# Altium project Heli Altium Projectr.PrjPCB
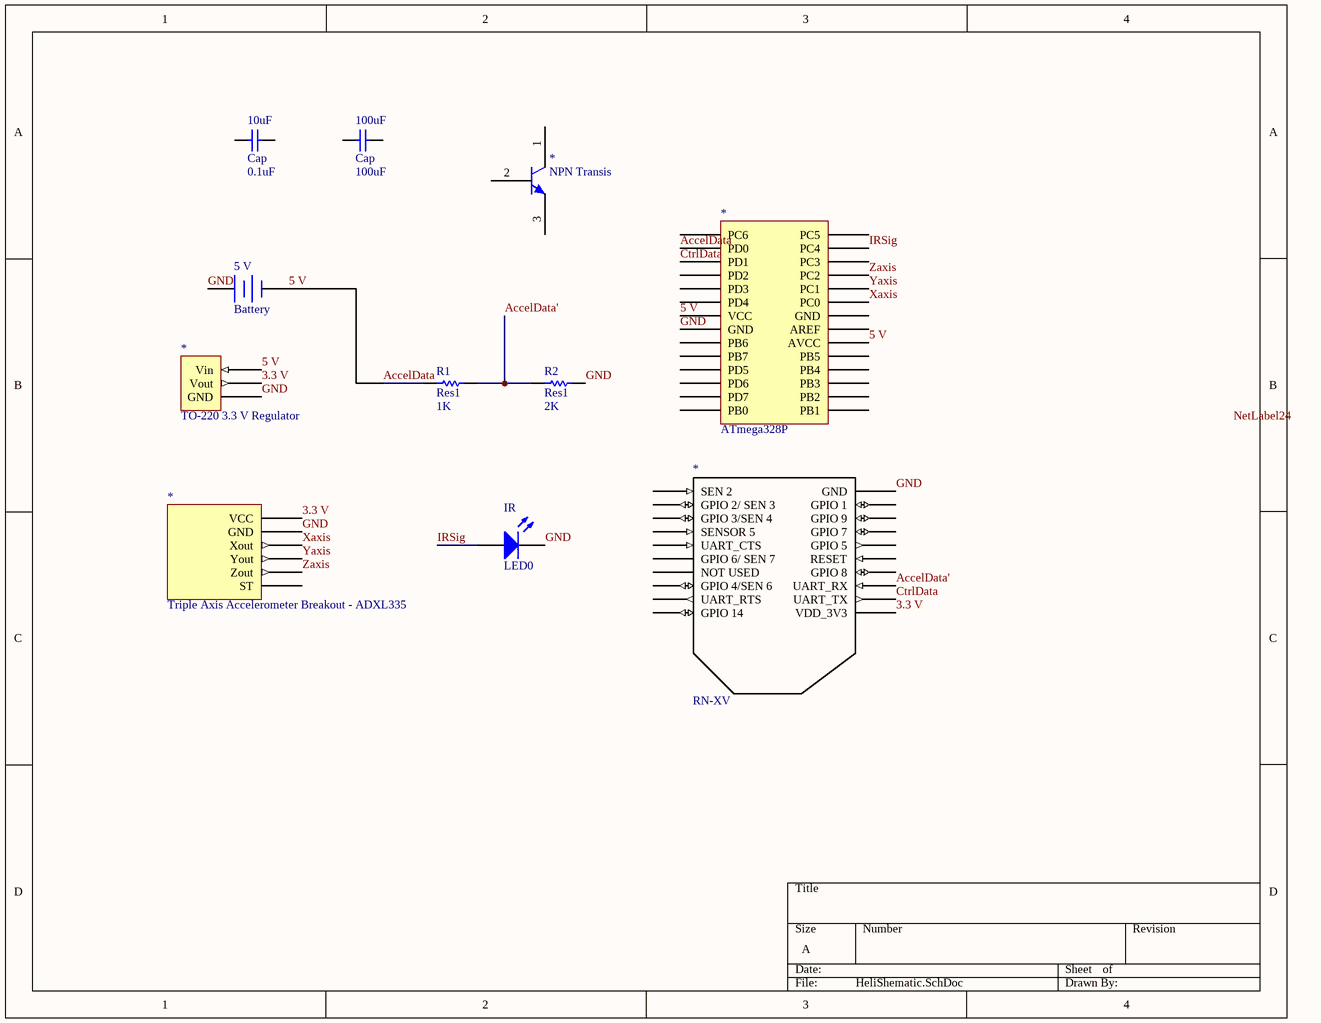
[diagram p0: HeliShematic.SchDoc]
1 sheet, 11 parts. Net scope: global (net labels, ports and power ports of the same name join across sheets).

## Sheet HeliShematic.SchDoc
size A

### Parts
(Parts that share a designator on the sheet are numbered #1, #2 ... from top to bottom, then left to right.)
5_V  Battery  [BAT-2]
10uF  Cap  value 0.1uF  [CAPC2012X14N]
100uF  Cap  value 100uF  [Capacitor 100uF]
*#1  NPN Transis  [SOT95P237X112-3N]
*#2  ATmega328P
*#3  TO-220 3.3 V Regulator
*#4  Triple Axis Accelerometer Breakout - ADXL335
*#5  RN-XV
IR  LED0  [LED-0]
R1  Res1  value 1K  [AXIAL-0.3]
R2  Res1  value 2K  [AXIAL-0.3]

### Nets
3.3 V: *#3.2(Vout) *#4.14(VCC) *#5.1(VDD_3V3)
5 V: 5_V.2(-) *#2.?2(VCC) *#2.?15(AVCC) *#3.3(Vin)
AccelData: *#2.2(PD0) R1.1
AccelData': *#5.3(UART_RX) R1.2 R2.1
CtrlData: *#2.3(PD1) *#5.2(UART_TX)
GND: 5_V.1(+) *#2.?3(GND) *#3.1(GND) *#4.13(GND) *#5.10(GND) IR.2(K) R2.2
IRSig: *#2.?22(PC4) IR.1(A)
Xaxis: *#2.?18(PC0) *#4.12(Xout)
Yaxis: *#2.?19(PC1) *#4.10(Yout)
Zaxis: *#2.?20(PC2) *#4.8(Zout)

Not connected (* = marked no-connect by the designer): 10uF 1 2; 100uF 1 2; *#1 1 2 3; *#2 1(PC6) 4(PD2) 5(PD3) ?1(PD4) ?4(PB6) ?5(PB7) ?6(PD5) ?7(PD6) ?8(PD7) ?9(PB0) ?10(PB1) ?11(PB2) ?12(PB3) ?13(PB4) ?14(PB5) ?16(AREF) ?17(GND) ?21(PC3) ?23(PC5); *#4 2(ST); *#5 4(GPIO_8) 5(RESET) 6(GPIO_5) 7(GPIO_7) 8(GPIO_9) 9(GPIO_1) 11(GPIO_14) 12(UART_RTS) 13(GPIO_4/SEN_6) 14(NOT_USED) 15(GPIO_6/_SEN_7) 16(UART_CTS) 17(SENSOR_5) 18(GPIO_3/SEN_4) 19(GPIO_2/_SEN_3) 20(SEN_2)

### Notes on the sheet
- Labels drawn without touching a wire or pin: NetLabel24

### Library data of the parts
5_V = Battery: Multicell Battery; Published: 24-Mar-1999; LatestRevisionDate: 17-Jul-2002; LatestRevisionNote: Re-released for DXP Platform.; PackageReference: BAT-2; Publisher: Altium Limited; PackageDescription: Battery; 2 Leads
10uF 100uF = Cap: Capacitor; Published: 8-Jun-2000; LatestRevisionDate: 17-Jul-2002; LatestRevisionNote: Re-released for DXP Platform.; PackageReference: RAD-0.3; Publisher: Altium Limited; PackageDescription: Radial Cap, Thru-Hole; 2 Leads; 0.3 in Pin Spacing
*#1 = Transistor
IR = LED0: Typical INFRARED GaAs LED; Published: 8-Jun-2000; LatestRevisionDate: 08-Jul-2005; LatestRevisionNote: Mech Layer 1 removed.; PackageReference: LED-0; Publisher: Altium Limited; PackageDescription: LED; 2 Leads
R1 R2 = Res1: Resistor; Published: 8-Jun-2000; LatestRevisionDate: 17-Jul-2002; LatestRevisionNote: Re-released for DXP Platform.; PackageReference: AXIAL-0.3; Publisher: Altium Limited; PackageDescription: Axial Device, Thru-Hole; 2 Leads; 0.3 in Pin Spacing